# EAGLE design PCB-RS422-DB9-BO (EAGLE 6.4)

## Sheet 1 of 2
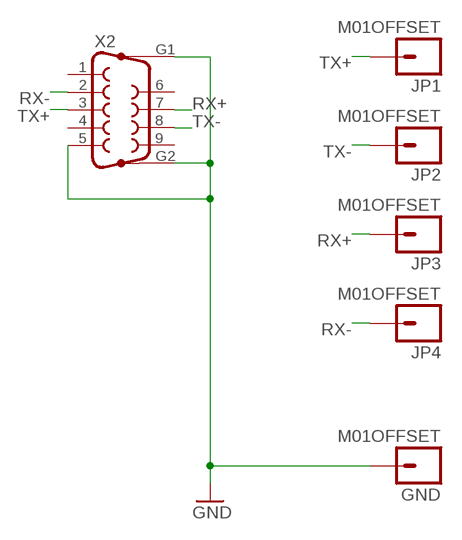
[diagram p0: schematic, sheet 1]

### Parts
GND  M01OFFSET  [1X01_OFFSET]
JP1  M01OFFSET  [1X01_OFFSET]
JP2  M01OFFSET  [1X01_OFFSET]
JP3  M01OFFSET  [1X01_OFFSET]
JP4  M01OFFSET  [1X01_OFFSET]
X2  F09HP  [F09HP]

### Nets
GND [Power]: GND.1 X2.5 X2.G1 X2.G2
RX+: JP3.1 X2.7
RX-: JP4.1 X2.2
TX+: JP1.1 X2.3
TX-: JP2.1 X2.8
Unconnected: X2.1 X2.4 X2.6 X2.9

## Sheet 2 of 2

## Library data of the parts
GND JP1-JP4 = SparkFun:M01: Header 1 Standard 1-pin 0.1" header. Use with straight break away headers (SKU : PRT-00116), right angle break away headers (PRT-00553), swiss pins (PRT-00743), machine pins (PRT-00117), and female headers (PRT-00115).
X2 = con-subd:F09HP: SUB-D; OC_FARNELL: unknown; OC_NEWARK: unknown

## Net classes
0 default: width 0.203 mm, drill 0.406 mm, clearance 0.203 mm
1 Power: width 0.406 mm, drill 0.61 mm, clearance 0.203 mm
2 RELAY LINES: width 0.305 mm, drill 0.406 mm, clearance 0.254 mm
3 INput lines: width 0.203 mm, drill 0.406 mm, clearance 0.254 mm

## Board
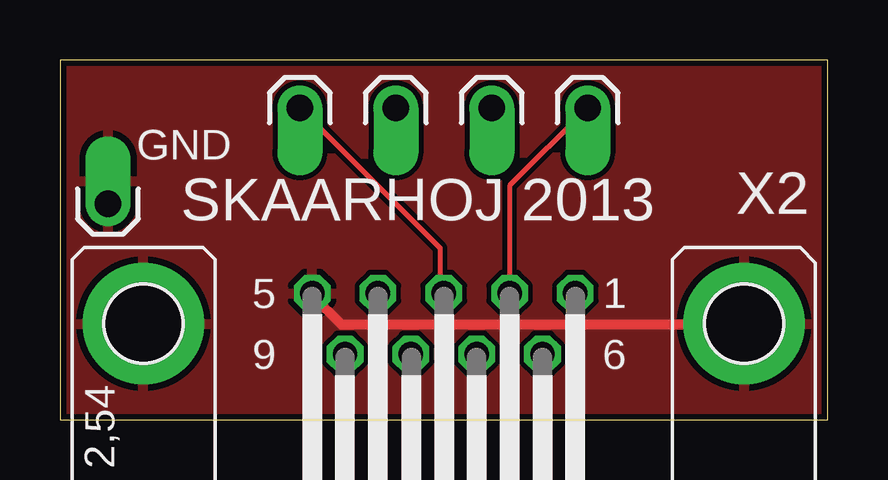
[diagram p1: board, top side]
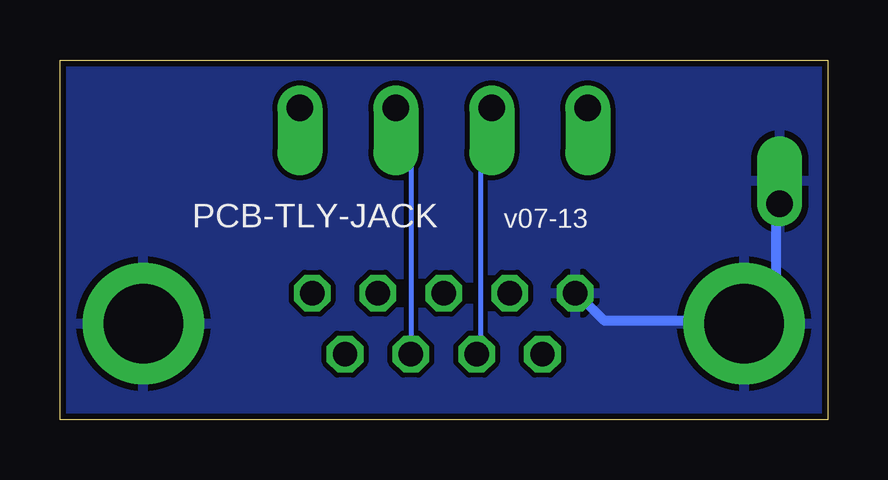
[diagram p2: board, bottom side, seen from below]

Size 32 x 15 mm. Coordinates in mm from the lower left corner, seen from the top.
Outline: 32,0 32,15 0,15 0,0 32,0
Copper layers (1*16): Top 0.035mm / dielectric 1.5mm / Bottom 0.035mm
Design rules "Fusion_eagle_rule_v1.1": minimum track width 6mil, minimum drill 12mil, track to track 6mil, track to pad 6mil, pad to pad 6mil, via to via 6mil, smd to smd 0mil, copper to edge 10mil, drill to drill 10mil, minimum pad ring 10mil, minimum via ring 6mil, stop-mask expansion 2mil, vias tented up to drill 100mil, thermal gap 10mil

### Footprints (pad centres in the part's own frame; a part is rotated, then mirrored left to right if it is on the bottom)
1X01_OFFSET = drill 1.118 pad 1.88 offset: 1 0,0
F09HP = drill 1.016 octagon: 1 -5.486,-1.27; 2 -2.743,-1.27; 3 0,-1.27; 4 2.743,-1.27; 5 5.486,-1.27; 6 -4.115,1.27; 7 -1.372,1.27; 8 1.372,1.27; 9 4.115,1.27 | drill 3.302 pad 5.08: G1 -12.522,0; G2 12.522,0

### Placement (x,y rotation side)
GND  2,9 0 top
JP1  10,13 180 top
JP2  14,13 180 top
JP3  18,13 180 top
JP4  22,13 180 top
X2  16,4 180 top

### Tracks (layer width: path | path; a pad name or v marks a point on that pad's centre or on a via)
GND
  Top 0.406: X2.G1 28.5,3.96 11.73,3.96 10.52,5.18 X2.5
  Bottom 0.406: X2.5 10.36,5.18 9.3,4.12 3.5,4.12 X2.G2 3.5,4.27 2.13,4.27 2.13,8.99 GND.1
  pour Top: 0,0 32,0 32,15 0,15
  pour Bottom: 0,0 32,0 32,15 0,15
RX+
  Bottom 0.203: X2.7 17.37,2.74 17.37,12.95 17.98,12.95 JP3.1
RX-
  Top 0.203: X2.2 18.75,5.33 18.75,9.75 21.95,12.95 JP4.1
TX+
  Top 0.203: X2.3 15.85,5.33 15.85,7.16 10.06,12.95 JP1.1
TX-
  Bottom 0.203: X2.8 14.48,2.74 14.48,12.95 14.02,12.95 JP2.1

### Text on the board
_tsilk: SKAARHOJ 2013
_bsilk: v07-13 | PCB-TLY-JACK